# EAGLE design MPL3115A2 (EAGLE 7.5.0)
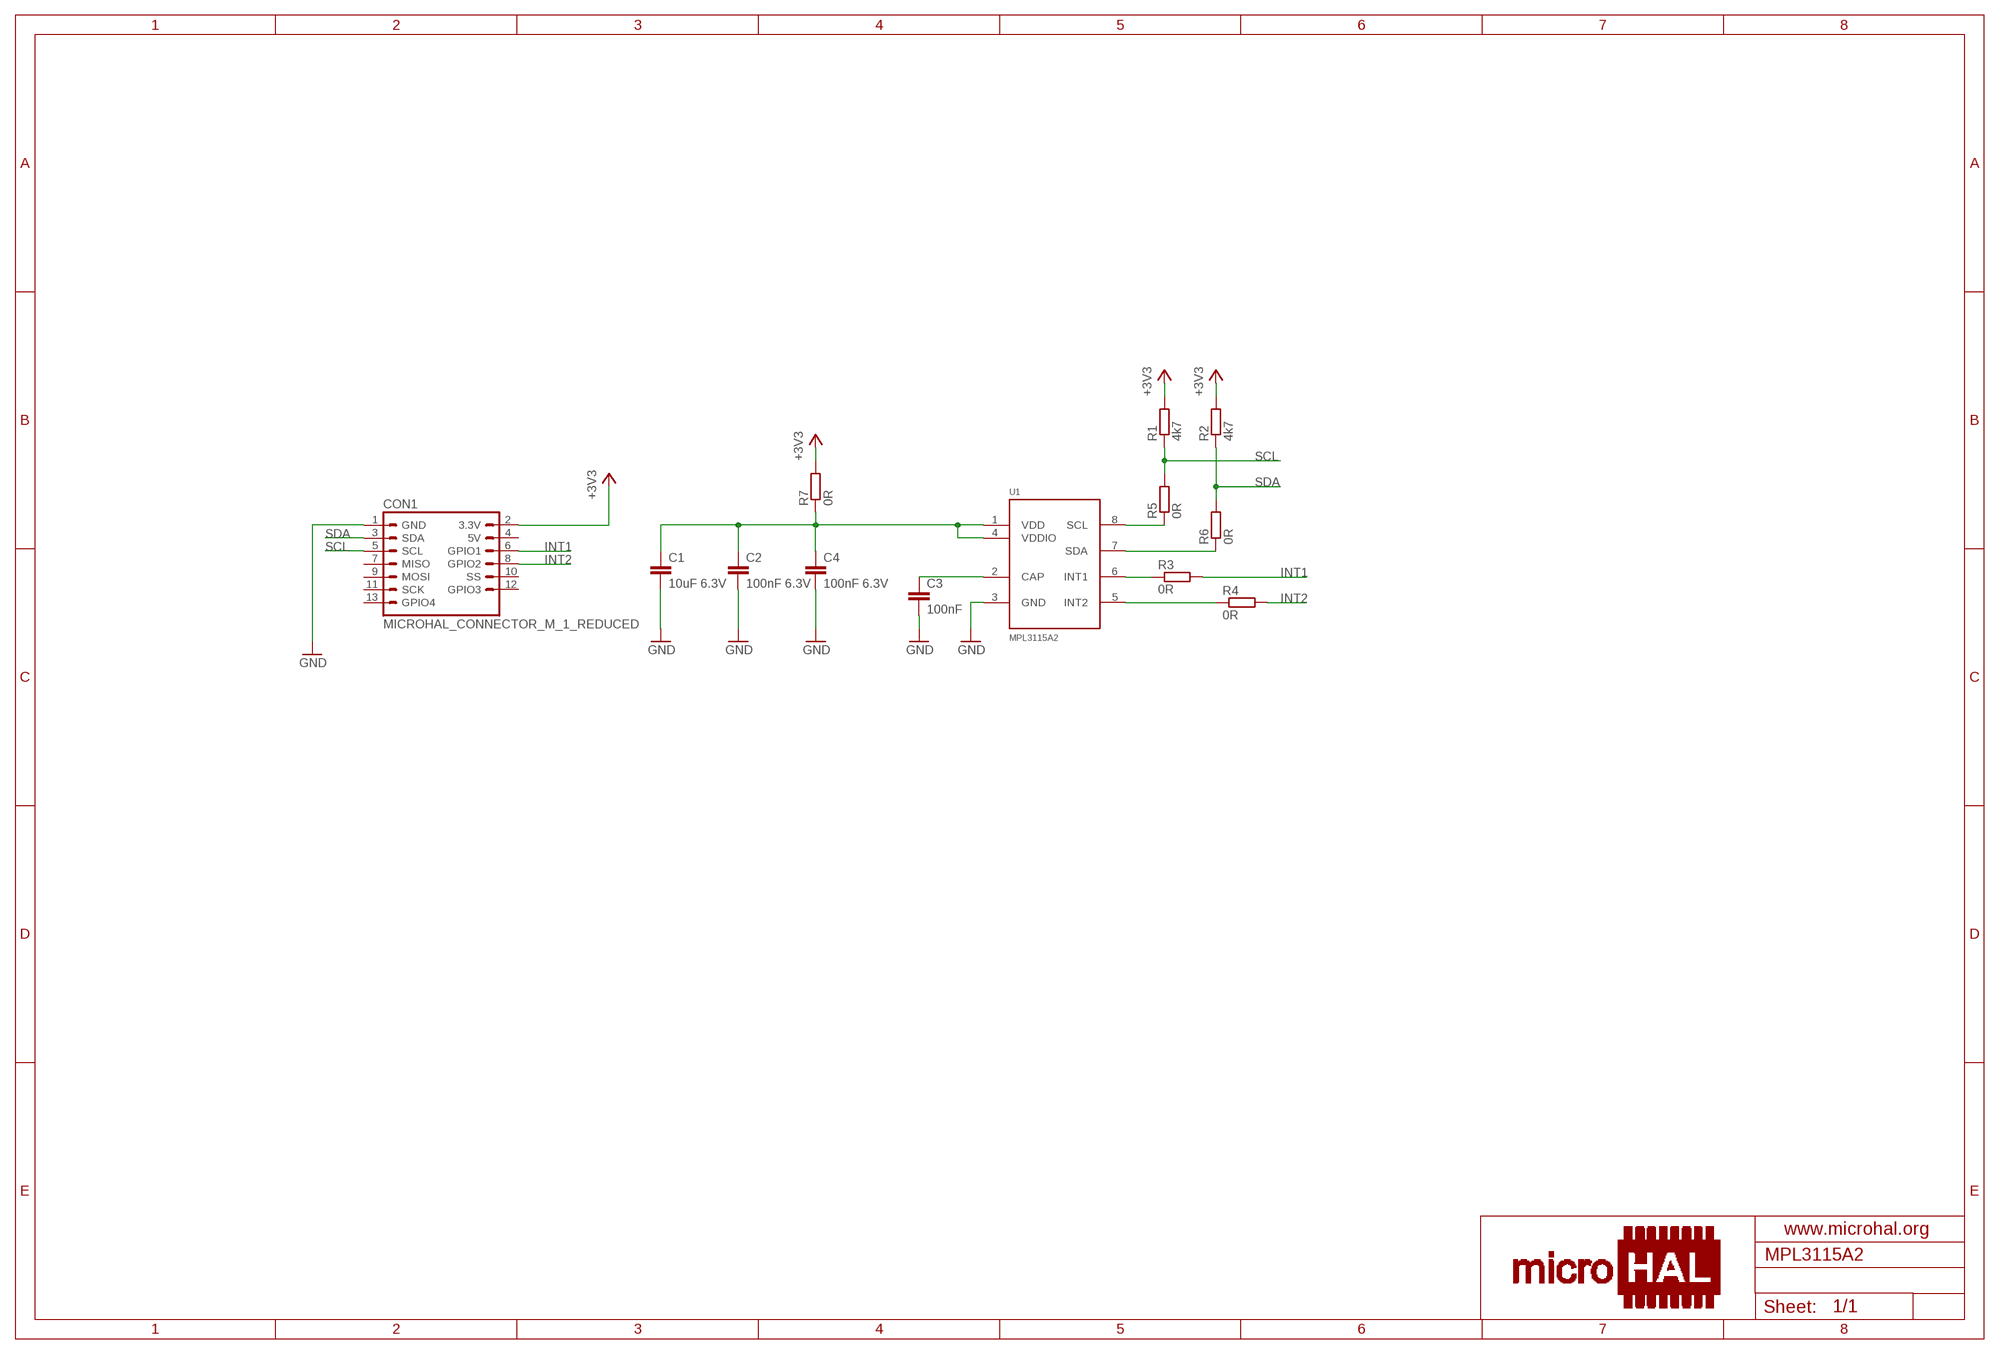
[diagram p0: schematic, sheet 1]

## Parts
C1  10uF 6.3V  C-EUC0603K  [C0603K]
C2  100nF 6.3V  C-EUC0603K  [C0603K]
C3  100nF  C-EUC0603K  [C0603K]
C4  100nF 6.3V  C-EUC0603K  [C0603K]
CON1  MICROHAL_CONNECTOR_M_1_REDUCED  [MICROHAL_CONNECTOR_M_1_REDUCED_EDGE]
R1  4k7  R-EU_R0603  [R0603]
R2  4k7  R-EU_R0603  [R0603]
R3  0R  R-EU_R0603  [R0603]
R4  0R  R-EU_R0603  [R0603]
R5  0R  R-EU_R0603  [R0603]
R6  0R  R-EU_R0603  [R0603]
R7  0R  R-EU_R0603  [R0603]
U1  MPL3115A2  [MPL3115A2]

## Nets
+3V3: CON1.2(3.3V) R1.2 R2.2 R7.2
GND: C1.2 C2.2 C3.2 C4.2 CON1.1(GND) U1.3(GND)
INT1: CON1.6(GPIO1) R3.2
INT2: CON1.8(GPIO2) R4.2
N$1: R5.1 U1.8(SCL)
N$2: R6.1 U1.7(SDA)
N$3: C1.1 C2.1 C4.1 R7.1 U1.1(VDD) U1.4(VDDIO)
N$6: C3.1 U1.2(CAP)
N$7: R3.1 U1.6(INT1)
N$8: R4.1 U1.5(INT2)
SCL: CON1.5(SCL) R1.1 R5.2
SDA: CON1.3(SDA) R2.1 R6.2
Unconnected: CON1.4(5V) CON1.7(MISO) CON1.9(MOSI) CON1.10(SS) CON1.11(SCK) CON1.12(GPIO3) CON1.13(GPIO4)

## Library data of the parts
C1-C4 = rcl:C-EU: CAPACITOR, European symbol
CON1 = microhal-connector_v0.1:MICROHAL_CONNECTOR_M_1_REDUCED
R1-R7 = rcl:R-EU_: RESISTOR, European symbol
U1 = mpl3115a2:MPL3115A2

## Board
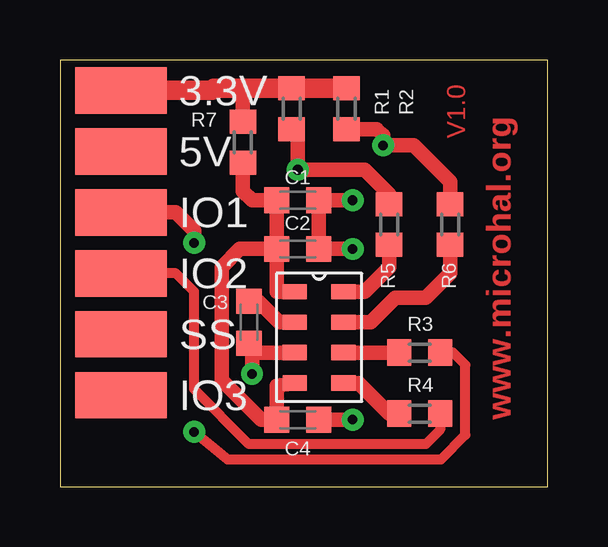
[diagram p1: board, top side]
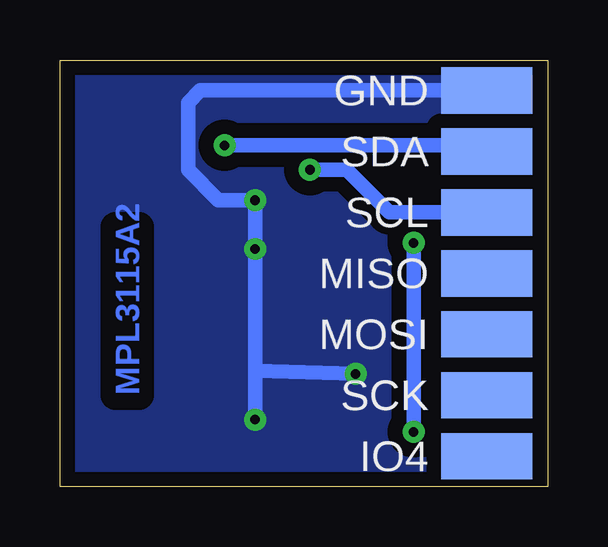
[diagram p2: board, bottom side, seen from below]

Size 20.32 x 17.78 mm. Coordinates in mm from the lower left corner, seen from the top.
Outline: 0,0 20.32,0 20.32,17.78 0,17.78 0,0
Copper layers (1*16): Top 0.035mm / dielectric 1.5mm / Bottom 0.035mm
Design rules "default *": minimum track width 10mil, minimum drill 15mil, track to track 8mil, track to pad 8mil, pad to pad 8mil, via to via 8mil, smd to smd 8mil, copper to edge 10mil, drill to drill 8mil, minimum pad ring 10mil, minimum via ring 8mil, stop-mask expansion 4mil, vias tented up to drill 16mil, thermal gap 10mil

### Footprints (pad centres in the part's own frame; a part is rotated, then mirrored left to right if it is on the bottom)
C0603K = smd 1.05 x 1.08: 1 -0.875,0; 2 0.875,0
MICROHAL_CONNECTOR_M_1_REDUCED_EDGE = smd 1.93 x 3.81 bottom: 1 -7.62,0; 3 -5.08,0; 5 -2.54,0; 7 0,0; 9 2.54,0; 11 5.08,0; 13 7.62,0 | smd 1.93 x 3.81: 2 -7.62,0; 4 -5.08,0; 6 -2.54,0; 8 0,0; 10 2.54,0; 12 5.08,0
R0603 = smd 1 x 1.1: 1 -0.85,0; 2 0.85,0
MPL3115A2 = smd 1.016 x 0.635: 1 -1.016,2.032; 2 -1.016,0.762; 3 -1.016,-0.508; 4 -1.016,-1.778; 5 1.016,-1.778; 6 1.016,-0.508; 7 1.016,0.762; 8 1.016,2.032

### Placement (x,y rotation side)
C1  9.91,11.94 0 top
C2  9.91,9.91 0 top
C3  7.87,6.86 270 top
C4  9.91,2.79 0 top
CON1  2.54,8.89 270 top
R1  9.65,15.75 90 top
R2  11.94,15.75 90 top
R3  14.99,5.59 0 top
R4  14.99,3.05 0 top
R5  13.72,10.92 90 top
R6  16.26,10.92 90 top
R7  7.62,14.35 90 top
U1  10.79,6.1 0 top

### Tracks (layer width: path | path; a pad name or v marks a point on that pad's centre or on a via)
+3V3
  Top 0.61: R7.2 7.62,16.6
  Top 0.813: CON1.2 6.35,16.51 arc-90 6.44,16.6 7.62,16.6 R1.2 R2.2
GND  (via drill 0.4 pad 0.91)
  Top 0.61: C4.2 v12.19,2.79 | v12.19,9.91 C2.2 C1.2 v12.19,11.94 | 8,5.59 8,5.98 C3.2 | U1.3 8,5.59 | 8,5.59 v8,4.7
  Bottom 0.61: 12.19,4.83 v12.19,9.91 v12.19,11.94 13.72,11.94 14.99,13.21 14.99,16 14.48,16.51 CON1.1 | 12.19,4.83 v12.19,2.79 | v8,4.7 12.19,4.83
  pour Bottom (isolate 0.61, no thermals): 0,17.78 20.32,17.78 20.32,0 2.03,0 0,0
INT1  (via drill 0.4 pad 0.91)
  Top 0.406: v5.59,2.29 6.99,1.14 15.88,1.14 16.89,2.16 16.89,5.08 16.38,5.59 R3.2
  Top 0.61: v5.59,10.16 5.59,10.67 4.83,11.43 CON1.6
  Bottom 0.61: v5.59,2.29 v5.59,10.16
INT2
  Top 0.406: R4.2 15.84,2.37 15.24,1.78 7.87,1.78 5.59,4.06 5.59,8.13 4.83,8.89 CON1.8
N$1
  Top 0.61: U1.8 12.7,8.13 13.72,9.14 R5.1
N$2
  Top 0.61: U1.7 12.95,6.86 13.97,7.87 15.24,7.87 16.26,8.89 R6.1
N$3
  Top 0.61: U1.4 9.03,4.21 C4.1 8.38,2.79 6.73,4.45 6.73,9.14 7.49,9.91 C2.1 | U1.1 9.03,8.13 C2.1 | C2.1 C1.1 8,11.94 7.62,12.32 R7.1
N$6
  Top 0.406: 7.76,7.99 C3.1
  Top 0.61: U1.2 9.14,6.86 8.27,7.73 C3.1
N$7
  Top 0.61: U1.6 R3.1
N$8
  Top 0.61: U1.5 12.45,4.32 13.72,3.05 R4.1
SCL  (via drill 0.4 pad 0.91)
  Top 0.61: R5.2 13.72,12.19 12.7,13.21 v9.91,13.21 9.91,14.64 arc90 R1.1
  Bottom 0.61: CON1.5 6.6,11.43 8.38,13.21 v9.91,13.21
SDA  (via drill 0.4 pad 0.91)
  Top 0.61: R2.1 13.21,14.9 13.46,14.64 v13.46,14.22 14.73,14.22 16.26,12.7 R6.2
  Bottom 0.61: CON1.3 2.79,14.22 v13.46,14.22

### Text on the board
Top: V1.0 | www.microhal.org
Bottom: MPL3115A2
tStop: www.microhal.org